# EAGLE design circuit_0.3.1 (EAGLE 7.7.0)
REV: 1
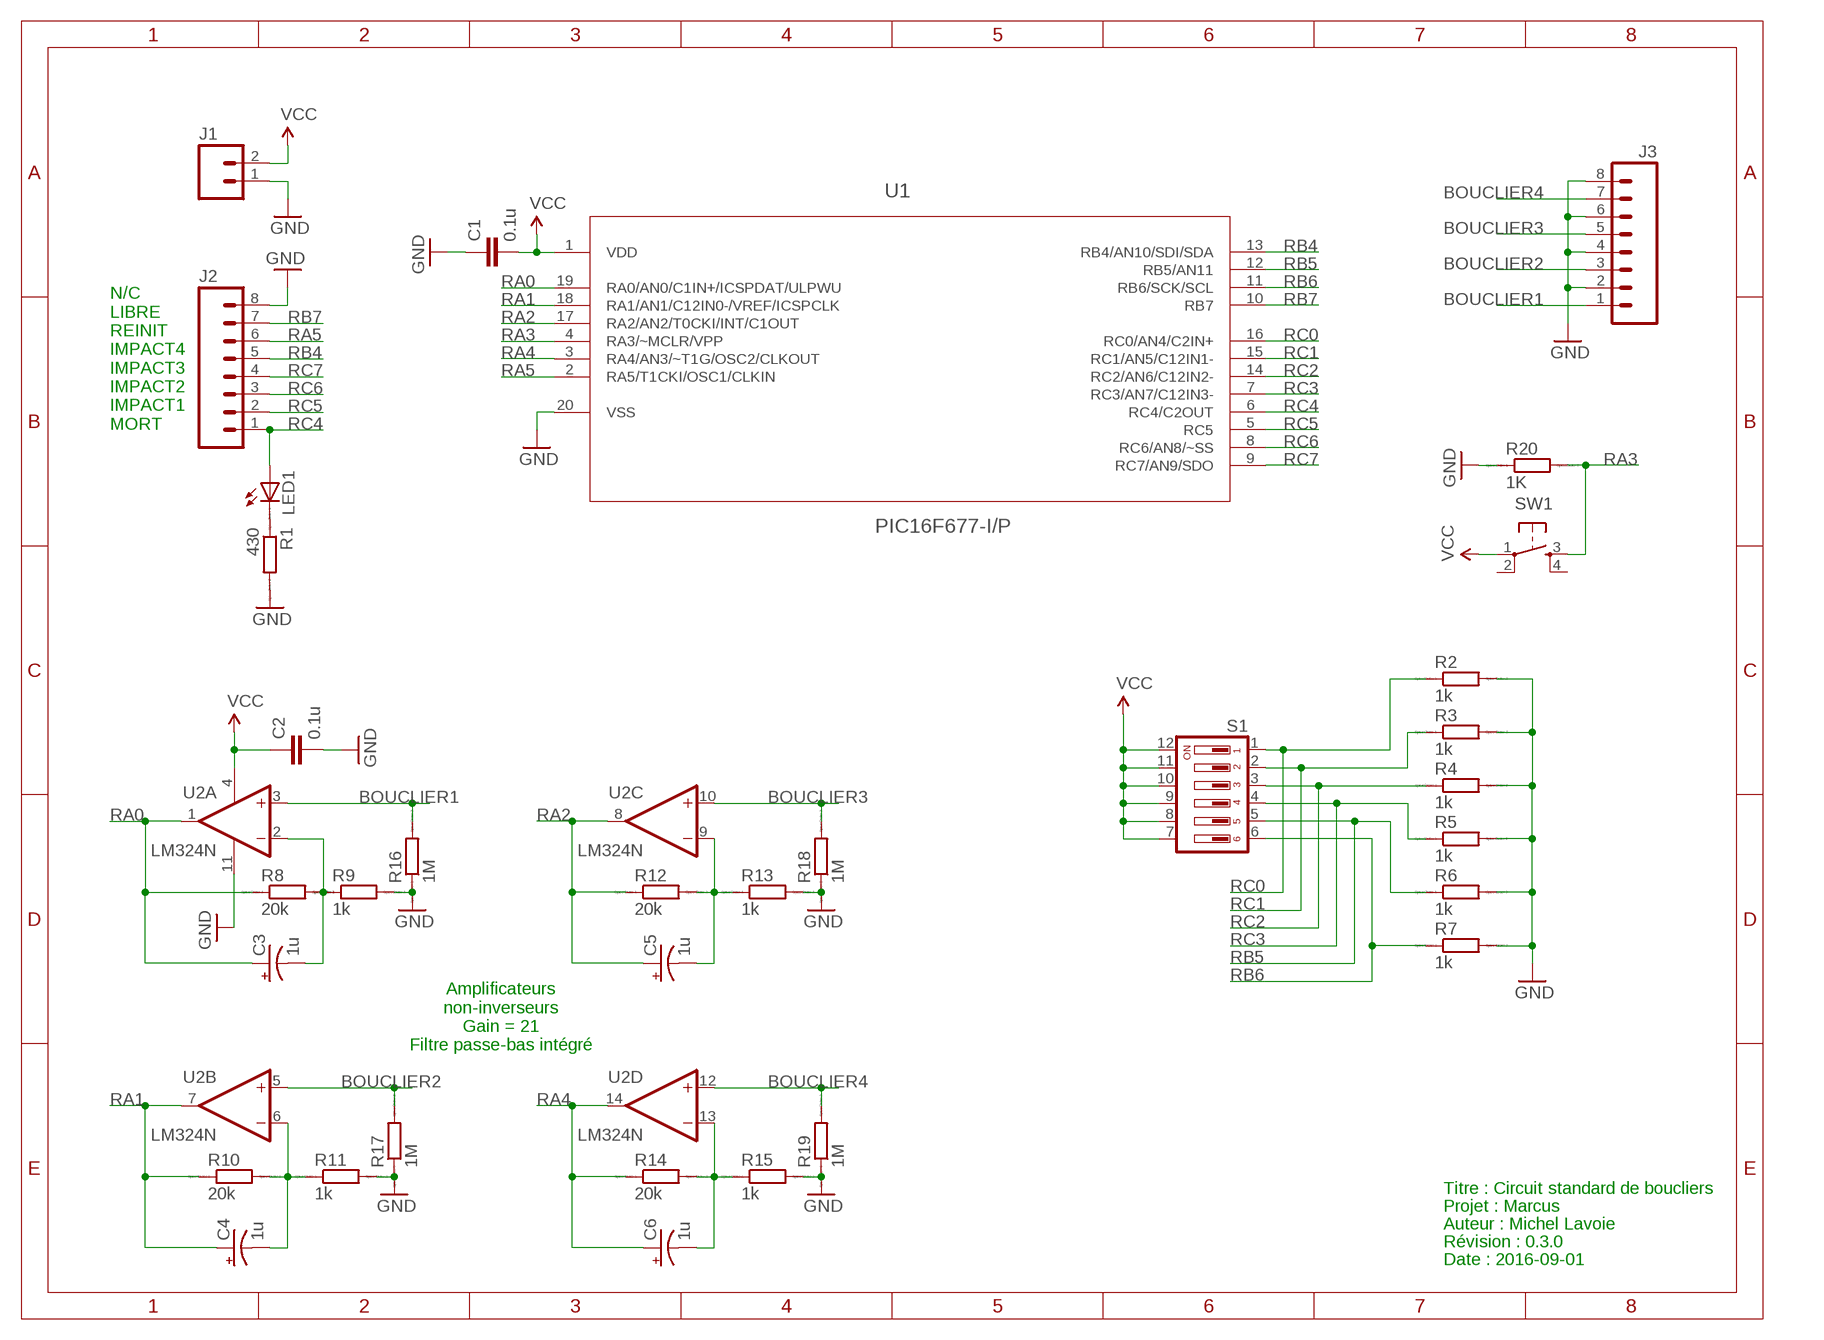
[diagram p0: schematic, sheet 1]

## Parts
C1  0.1u  CAPPTH  [CAP-PTH-SMALL]
C2  0.1u  CAPPTH  [CAP-PTH-SMALL]
C3  1u  CPOL-USE2.5-5  [E2,5-5]
C4  1u  CPOL-USE2.5-5  [E2,5-5]
C5  1u  CPOL-USE2.5-5  [E2,5-5]
C6  1u  CPOL-USE2.5-5  [E2,5-5]
J1  M02PTH  [1X02]
J2  M08NO_SILK  [1X08_PIN1_NO_SILK]
J3  M08NO_SILK  [1X08_PIN1_NO_SILK]
LED1  LED3MM  [LED3MM]
R1  430  R0207/10  [0207/10]
R2  1k  R0207/10  [0207/10]
R3  1k  R0207/10  [0207/10]
R4  1k  R0207/10  [0207/10]
R5  1k  R0207/10  [0207/10]
R6  1k  R0207/10  [0207/10]
R7  1k  R0207/10  [0207/10]
R8  20k  R0207/10  [0207/10]
R9  1k  R0207/10  [0207/10]
R10  20k  R0207/10  [0207/10]
R11  1k  R0207/10  [0207/10]
R12  20k  R0207/10  [0207/10]
R13  1k  R0207/10  [0207/10]
R14  20k  R0207/10  [0207/10]
R15  1k  R0207/10  [0207/10]
R16  1M  R0207/10  [0207/10]
R17  1M  R0207/10  [0207/10]
R18  1M  R0207/10  [0207/10]
R19  1M  R0207/10  [0207/10]
R20  1K  R0207/10  [0207/10]
S1  DIP06YL  [DIP06YL]
SW1  TAC_SWITCHPTH  [TACTILE-PTH]
U1  PIC16F677-I/P  [DIP254P762X533-20]
U2  LM324N  [DIL14]

## Nets
BOUCLIER1: J3.1 R16.2 U2.3(A:+IN)
BOUCLIER2: J3.3 R17.2 U2.5(B:+IN)
BOUCLIER3: J3.5 R18.2 U2.10(C:+IN)
BOUCLIER4: J3.7 R19.2 U2.12(D:+IN)
GND: C1.1 C2.2 J1.1 J2.8 J3.2 J3.4 J3.6 J3.8 R1.2 R2.2 R3.2 R4.2 R5.2 R6.2 R7.2 R9.2 R11.2 R13.2 R15.2 R16.1 R17.1 R18.1 R19.1 R20.1 U1.20(VSS) U2.11(P:V-)
N$1: C4.- R10.2 R11.1 U2.6(B:-IN)
N$2: LED1.K(C) R1.1
N$3: C3.- R8.2 R9.1 U2.2(A:-IN)
N$5: C5.- R12.2 R13.1 U2.9(C:-IN)
N$6: C6.- R14.2 R15.1 U2.13(D:-IN)
RA0: C3.+ R8.1 U1.19(RA0/AN0/C1IN+/ICSPDAT/ULPWU) U2.1(A:OUT)
RA1: C4.+ R10.1 U1.18(RA1/AN1/C12IN0-/VREF/ICSPCLK) U2.7(B:OUT)
RA2: C5.+ R12.1 U1.17(RA2/AN2/T0CKI/INT/C1OUT) U2.8(C:OUT)
RA3: R20.2 SW1.3 U1.4(RA3/~MCLR/VPP)
RA4: C6.+ R14.1 U1.3(RA4/AN3/~T1G/OSC2/CLKOUT) U2.14(D:OUT)
RA5: J2.6 U1.2(RA5/T1CKI/OSC1/CLKIN)
RB4: J2.5 U1.13(RB4/AN10/SDI/SDA)
RB5: R6.1 S1.5 U1.12(RB5/AN11)
RB6: R7.1 S1.6 U1.11(RB6/SCK/SCL)
RB7: J2.7 U1.10(RB7)
RC0: R2.1 S1.1 U1.16(RC0/AN4/C2IN+)
RC1: R3.1 S1.2 U1.15(RC1/AN5/C12IN1-)
RC2: R4.1 S1.3 U1.14(RC2/AN6/C12IN2-)
RC3: R5.1 S1.4 U1.7(RC3/AN7/C12IN3-)
RC4: J2.1 LED1.A U1.6(RC4/C2OUT)
RC5: J2.2 U1.5(RC5)
RC6: J2.3 U1.8(RC6/AN8/~SS)
RC7: J2.4 U1.9(RC7/AN9/SDO)
VCC: C1.2 C2.1 J1.2 S1.7 S1.8 S1.9 S1.10 S1.11 S1.12 SW1.1 U1.1(VDD) U2.4(P:V+)
Unconnected: SW1.2 SW1.4

## Notes on the sheet
- N/C
  LIBRE
  REINIT
  IMPACT4
  IMPACT3
  IMPACT2
  IMPACT1
  MORT
- Amplificateurs
  non-inverseurs
  Gain = 21
  Filtre passe-bas intégré
- Titre : Circuit standard de boucliers
- Projet : Marcus
- Auteur : Michel Lavoie
- Révision : 0.3.0
- Date : 2016-09-01

## Library data of the parts
C1 C2 = SparkFun-Capacitors:CAP: Capacitor Standard 0603 ceramic capacitor, and 0.1" leaded capacitor.
C3-C6 = adafruit:CPOL-US: POLARIZED CAPACITOR, American symbol
J1 = SparkFun-Connectors:M02: Standard 2-pin 0.1" header. Use with - straight break away headers ( PRT-00116) - right angle break away headers (PRT-00553) - swiss pins (PRT-00743) - machine pins (PRT-00117) - female headers (PRT-00115) Molex polarized connector foot print use with: PRT-08233 with associated crimp pins and housings. 2.54_SCREWTERM for use with PRT-10571. 3.5mm Screw Terminal footprints for PRT-08084 5mm Screw Terminal footprints for use with PRT-08432
J2 J3 = SparkFun-Connectors:M08: Header 8 Standard 8-pin 0.1" header. Use with straight break away headers (SKU : PRT-00116), right angle break away headers (PRT-00553), swiss pins (PRT-00743), machine pins (PRT-00117), and female headers (PRT-00115).
LED1 = adafruit:LED: LED OSRAM: - CHIPLED LG R971, LG N971, LY N971, LG Q971, LY Q971, LO R971, LY R971 LH N974, LH R974 LS Q976, LO Q976, LY Q976 LO Q996 - Hyper CHIPLED LW Q18S LB Q993, LB Q99A, LB R99A - SideLED LS A670, LO A670, LY A670, LG A670, LP A670 LB A673, LV A673, LT A673, LW A673 LH A674 LY A675 LS A676, LA A676, LO A676, LY A676, LW A676 LS A679, LY A679, LG A679 - Hyper Micro SIDELED® LS Y876, LA Y876, LO Y876, LY Y876 LT Y87S - SmartLED LW L88C, LW L88S LB L89C, LB L89S, LG L890 LS L89K, LO L89K, LY L89K LS L896, LA L896, LO L896, LY L896 - TOPLED LS T670, LO T670, LY T670, LG T670, LP T670 LSG T670, LSP T670, LSY T670, LOP T670, LYG T670 LG T671, LOG T671, LSG T671 LB T673, LV T673, LT T673, LW T673 LH T674 LS T676, LA T676, LO T676, LY T676, LB T676, LH T676, LSB T676, LW T676 LB T67C, LV T67C, LT T67C, LS T67K, LO T67K, LY T67K, LW E67C LS E67B, LA E67B, LO E67B, LY E67B, LB E67C, LV E67C, LT E67C LW T67C LS T679, LY T679, LG T679 LS T770, LO T770, LY T770, LG T770, LP T770 LB T773, LV T773, LT T773, LW T773 LH T774 LS E675, LA E675, LY E675, LS T675 LS T776, LA T776, LO T776, LY T776, LB T776 LHGB T686 LT T68C, LB T68C - Hyper Mini TOPLED® LB M676 - Mini TOPLED Santana® LG M470 LS M47K, LO M47K, LY M47K Source: http://www.osram.convergy.de/
R1-R20 = eagle-ltspice:R: RESISTOR, European symbol; SPICEMODEL: NONE; SPICEPREFIX: R
S1 = switch-dil:DIP06YL: DIL/CODE SWITCH; OC_FARNELL: unknown; OC_NEWARK: unknown
SW1 = SparkFun-Retired:TAC_SWITCH: Momentary Switch Button commonly used for reset or general input. Spark Fun Electronics SKU : COM-00097 SMT- SWCH-08247
U1 = Microchip_By_element14_Batch_1:PIC16F677-I/P: 8 Bit CMOS Microcontrollers; MPN: PIC16F677-I/P; OC_FARNELL: 1332206; OC_NEWARK: 56J7509; PACKAGE: PDIP-20; SUPPLIER: Microchip
U2 = linear:LM324: OP AMP

## Net classes
0 default: width 0.254 mm, clearance 0.305 mm

## Board
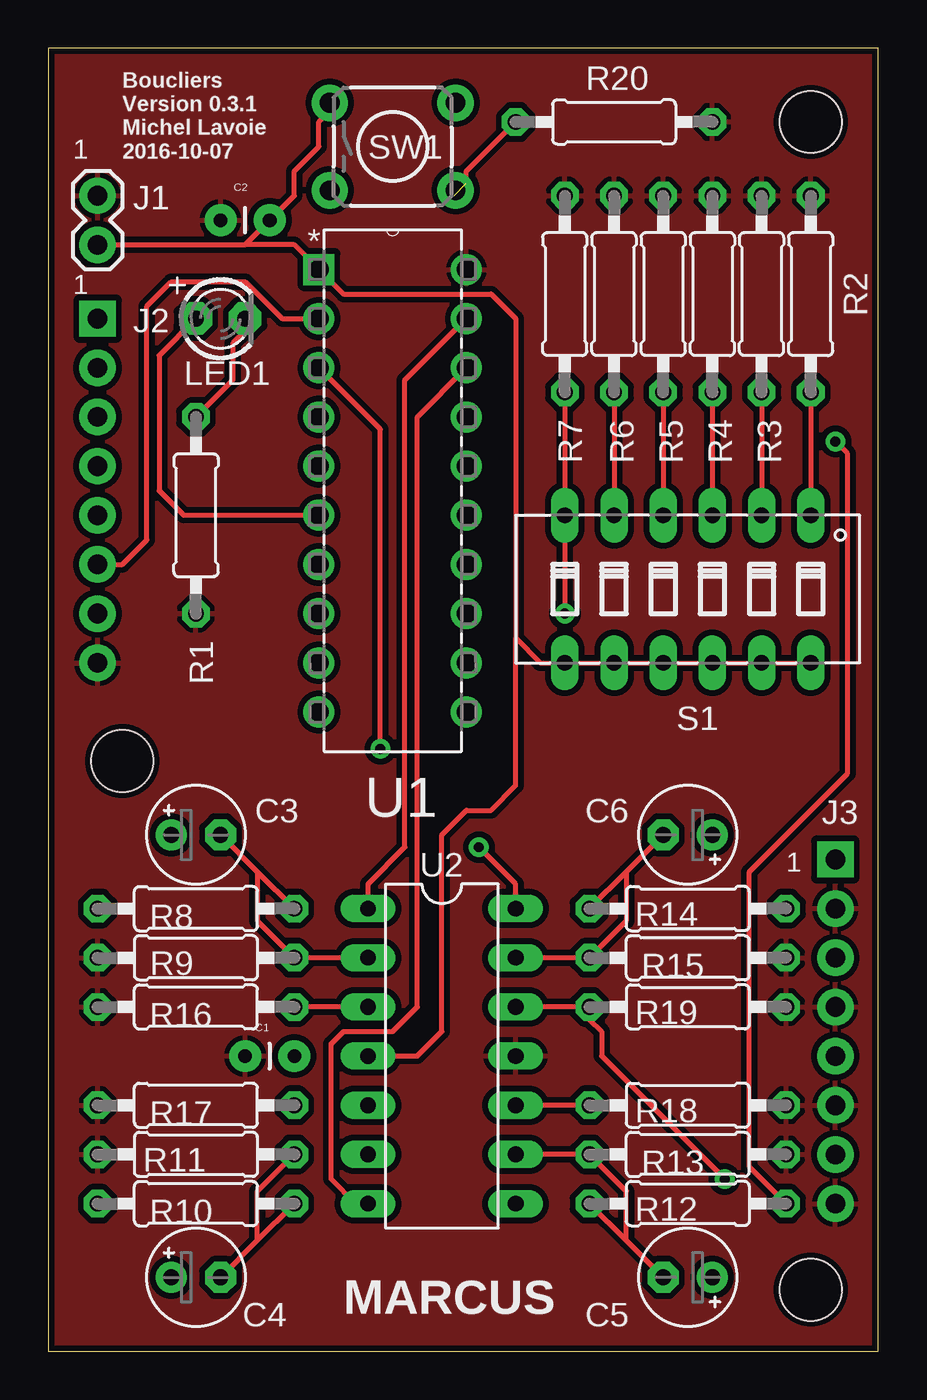
[diagram p1: board, top side]
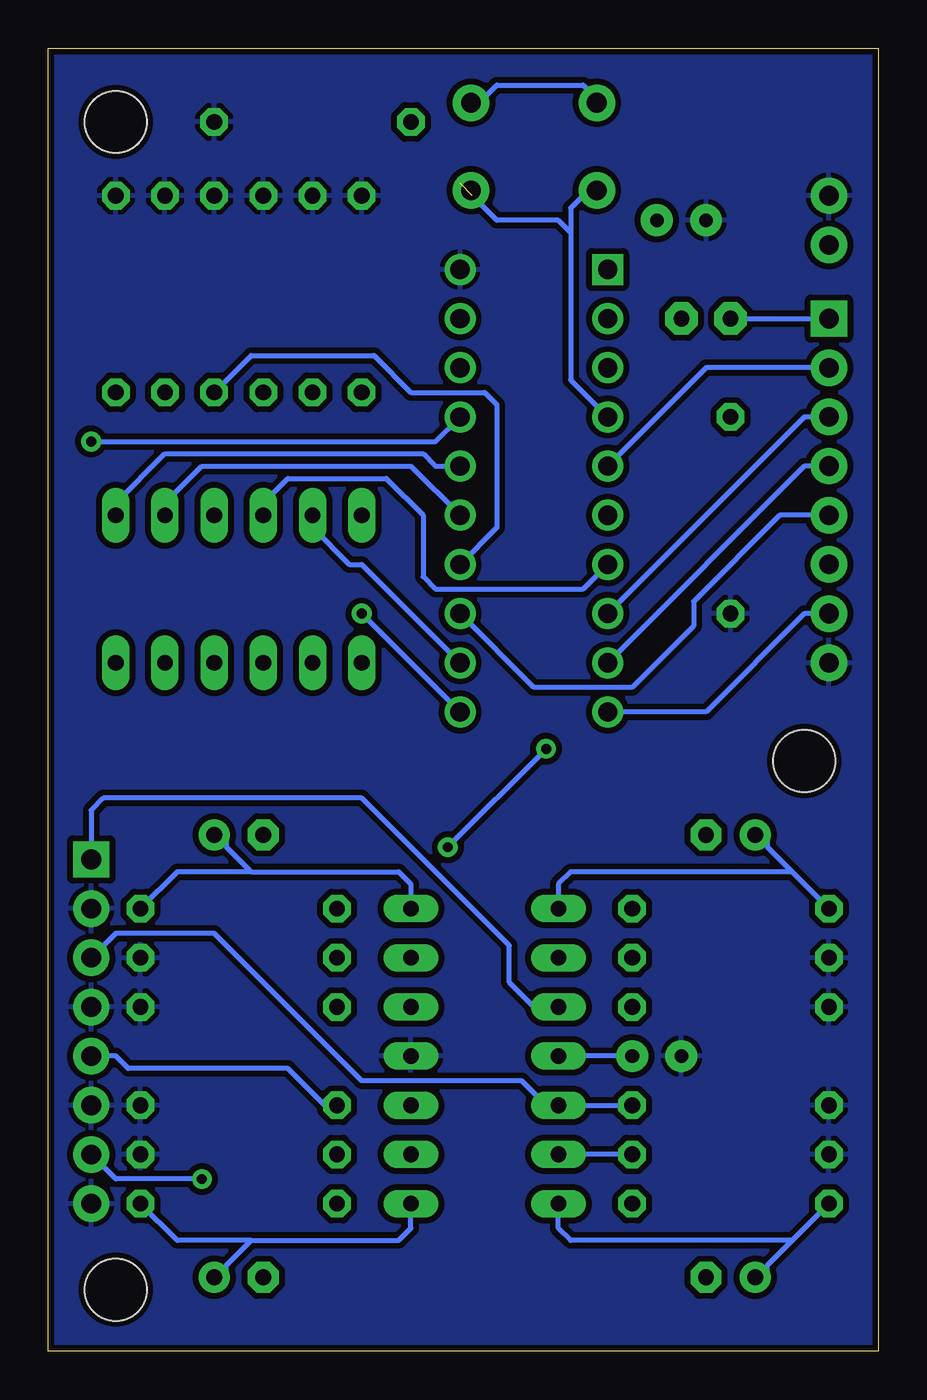
[diagram p2: board, bottom side, seen from below]

Size 42.85 x 67.3 mm. Coordinates in mm from the lower left corner, seen from the top.
Outline: 0,0 42.85,0 42.85,67.3 0,67.3 0,0
Copper layers (1*16): Top 0.035mm / dielectric 1.5mm / Bottom 0.035mm
Design rules "SparkFun": minimum track width 8mil, minimum drill 20mil, track to track 8mil, track to pad 8mil, pad to pad 8mil, via to via 8mil, smd to smd 8mil, copper to edge 8mil, drill to drill 8mil, minimum pad ring 12mil, minimum via ring 10mil, stop-mask expansion 4mil, vias tented up to drill 20mil, thermal gap 10mil
Holes 3.2 mm at 39.37,3.17 39.37,63.5 3.81,30.48

### Footprints (pad centres in the part's own frame; a part is rotated, then mirrored left to right if it is on the bottom)
CAP-PTH-SMALL = drill 0.7 pad 1.651: 1 0,0; 2 2.54,0
E2,5-5 = drill 0.813 pad 1.6: + -1.27,0 | drill 0.813 pad 1.6 octagon: - 1.27,0
1X02 = drill 1.016 pad 1.88: 1 0,0; 2 2.54,0
1X08_PIN1_NO_SILK = drill 1.016 pad 1.88 square: 1 0,0 | drill 1.016 pad 1.88: 2 2.54,0; 3 5.08,0; 4 7.62,0; 5 10.16,0; 6 12.7,0; 7 15.24,0; 8 17.78,0
LED3MM = drill 0.813 pad 1.676 octagon: A -1.27,0; K 1.27,0
0207/10 = drill 0.813 octagon: 1 -5.08,0; 2 5.08,0
DIP06YL = drill 0.813 long: 1 -6.35,-3.81; 2 -3.81,-3.81; 3 -1.27,-3.81; 4 1.27,-3.81; 5 3.81,-3.81; 6 6.35,-3.81; 7 6.35,3.81; 8 3.81,3.81; 9 1.27,3.81; 10 -1.27,3.81; 11 -3.81,3.81; 12 -6.35,3.81
TACTILE-PTH = drill 1.016 pad 1.88: 1 -3.251,2.261; 2 3.251,2.261; 3 -3.251,-2.261; 4 3.251,-2.261
DIP254P762X533-20 = drill 0.991 square: 1 -7.62,22.86 | drill 0.991: 2 -7.62,20.32; 3 -7.62,17.78; 4 -7.62,15.24; 5 -7.62,12.7; 6 -7.62,10.16; 7 -7.62,7.62; 8 -7.62,5.08; 9 -7.62,2.54; 10 -7.62,0; 11 0,0; 12 0,2.54; 13 0,5.08; 14 0,7.62; 15 0,10.16; 16 0,12.7; 17 0,15.24; 18 0,17.78; 19 0,20.32; 20 0,22.86
DIL14 = drill 0.813 long: 1 -7.62,-3.81; 2 -5.08,-3.81; 3 -2.54,-3.81; 4 0,-3.81; 5 2.54,-3.81; 6 5.08,-3.81; 7 7.62,-3.81; 8 7.62,3.81; 9 5.08,3.81; 10 2.54,3.81; 11 0,3.81; 12 -2.54,3.81; 13 -5.08,3.81; 14 -7.62,3.81

### Placement (x,y rotation side)
C1  10.16,15.24 0 top
C2  11.43,58.42 180 top
C3  7.62,26.67 0 top
C4  7.62,3.81 0 top
C5  33.02,3.81 180 top
C6  33.02,26.67 180 top
J1  2.54,59.69 270 top
J2  2.54,53.34 270 top
J3  40.64,25.4 270 top
LED1  8.89,53.34 0 top
R1  7.62,43.18 270 top
R2  39.37,54.61 90 top
R3  36.83,54.61 90 top
R4  34.29,54.61 90 top
R5  31.75,54.61 90 top
R6  29.21,54.61 90 top
R7  26.67,54.61 90 top
R8  7.62,22.86 0 top
R9  7.62,20.32 180 top
R10  7.62,7.62 0 top
R11  7.62,10.16 180 top
R12  33.02,7.62 180 top
R13  33.02,10.16 0 top
R14  33.02,22.86 180 top
R15  33.02,20.32 0 top
R16  7.62,17.78 0 top
R17  7.62,12.7 0 top
R18  33.02,12.7 180 top
R19  33.02,17.78 180 top
R20  29.21,63.5 180 top
S1  33.02,39.37 180 top
SW1  17.78,62.23 0 top
U1  21.59,33.02 0 top
U2  20.32,15.24 270 top

### Tracks (layer width: path | path; a pad name or v marks a point on that pad's centre or on a via)
BOUCLIER1
  Top 0.254: U2.3 R16.2
  Bottom 0.254: J3.1 40.64,27.94 40.01,28.57 26.67,28.57 19.05,20.95 19.05,19.05 17.78,17.78 U2.3
BOUCLIER2
  Bottom 0.254: R17.2 U2.5 17.14,12.7 18.41,13.97 26.67,13.97 34.29,21.59 39.37,21.59 J3.3
BOUCLIER3
  Top 0.254: R18.2 U2.10
  Bottom 0.254: J3.5 39.37,15.24 38.73,14.61 30.48,14.61 28.57,12.7 R18.2
BOUCLIER4  (via drill 0.51)
  Top 0.254: U2.12 R19.2 27.94,17.14 28.57,16.51 28.57,15.24 v34.92,8.89
  Bottom 0.254: J3.7 39.37,8.89 v34.92,8.89
GND
  pour Top (isolate 0.305): 0,67.31 43.18,67.31 43.18,0 0,0
  pour Bottom (isolate 0.305): 0,0 0,67.31 43.18,67.31 43.18,0
N$1
  Top 0.254: C4.- 10.79,5.71 | 10.79,5.71 R10.2 | R11.1 10.79,8.26 10.79,5.71
  Bottom 0.254: R11.1 U2.6
N$2
  Top 0.254: R1.1 9.53,50.16 9.53,52.07 10.16,52.7 LED1.K
N$3
  Top 0.254: U2.2 R9.1 10.79,22.23 10.79,24.77 | C3.- 10.79,24.77 | 10.79,24.77 R8.2
N$5
  Top 0.254: U2.9 R13.1 29.84,8.26 29.84,5.71 | C5.- 29.84,5.71 | 29.84,5.71 R12.2
N$6
  Top 0.254: U2.13 R15.1 29.84,22.23 29.84,24.77 | C6.- 29.84,24.77 | 29.84,24.77 R14.2
RA0
  Top 0.254: U1.19 18.41,50.16 18.41,26.04 16.51,24.13 U2.1
  Bottom 0.254: 4.45,24.77 5.71,26.04 5.71,26.67 C3.+ | 4.45,24.77 R8.1 | U2.1 16.51,24.13 15.88,24.77 4.45,24.77
RA1
  Top 0.254: U1.18 19.05,48.26 19.05,17.78 17.78,16.51 15.24,16.51 14.61,15.88 14.61,8.89 15.88,7.62 U2.7
  Bottom 0.254: 4.45,5.71 5.71,4.45 5.71,3.81 C4.+ | 4.45,5.71 R10.1 | U2.7 16.51,6.35 15.88,5.71 4.45,5.71
RA2  (via drill 0.51)
  Top 0.254: v40.64,46.99 41.27,46.35 41.27,29.84 36.2,24.77 36.2,9.53 R12.1
  Bottom 0.254: U2.8 24.13,6.35 24.77,5.71 32.38,5.71 | 32.38,5.71 33.66,4.45 33.66,3.81 C5.+ | R12.1 36.2,5.71 32.38,5.71 | U1.17 22.86,46.99 v40.64,46.99
RA3  (1 unrouted)
  Top 0.254: R20.2 21.59,60.96 21.59,60.33
  Bottom 0.254: U1.4 15.88,50.16 15.88,57.78 | 15.88,57.78 15.88,59.05 15.24,59.69 14.61,59.69 SW1.3 | 20.95,59.69 19.68,58.42 16.51,58.42 15.88,57.78
RA4  (via drill 0.51)
  Top 0.254: U1.3 17.14,47.62 v17.14,31.11 | v22.23,26.04 24.13,24.13 U2.14
  Bottom 0.254: U2.14 24.13,24.13 24.77,24.77 32.38,24.77 | 32.38,24.77 33.66,26.04 33.66,26.67 C6.+ | R14.1 36.2,24.77 32.38,24.77 | v22.23,26.04 v17.14,31.11
RA5
  Top 0.254: U1.2 12.06,53.34 10.16,55.24 6.35,55.24 5.08,53.98 5.08,41.91 3.81,40.64 J2.6
RB4
  Bottom 0.254: U1.13 17.78,34.29 12.7,34.29 9.53,37.47 9.53,38.73 5.08,43.18 J2.5
RB5
  Top 0.254: R6.1 S1.5
  Bottom 0.254: U1.12 26.67,40.64 27.3,40.64 29.21,42.55 S1.5
RB6  (via drill 0.51)
  Top 0.254: R7.1 S1.6 v26.67,38.1
  Bottom 0.254: v26.67,38.1 U1.11
RB7
  Bottom 0.254: U1.10 8.89,33.02 3.81,38.1 J2.7
RC0
  Top 0.254: R2.1 S1.1
  Bottom 0.254: U1.16 22.86,45.72 23.5,46.35 36.83,46.35 39.37,43.81 S1.1
RC1
  Top 0.254: R3.1 S1.2
  Bottom 0.254: U1.15 24.13,45.72 34.92,45.72 36.83,43.81 S1.2
RC2
  Top 0.254: R4.1 S1.3
  Bottom 0.254: U1.14 19.68,42.55 19.68,48.9 20.32,49.53 24.13,49.53 26.04,51.44 32.38,51.44 R4.1
RC3
  Top 0.254: R5.1 S1.4
  Bottom 0.254: U1.7 15.24,39.37 22.86,39.37 23.5,40.01 23.5,43.18 25.4,45.09 30.48,45.09 31.75,43.81 S1.4
RC4
  Top 0.254: U1.6 6.99,43.18 5.71,44.45 5.71,51.44 LED1.A
  Bottom 0.254: LED1.A J2.1
RC5
  Bottom 0.254: U1.5 8.89,50.8 J2.2
RC6
  Bottom 0.254: U1.8 3.81,48.26 J2.3
RC7
  Bottom 0.254: U1.9 3.81,45.72 J2.4
VCC
  Top 0.254: J1.2 10.16,57.15 | 10.16,57.15 C2.1 12.7,59.69 12.7,60.96 13.97,62.23 13.97,63.5 14.53,64.06 SW1.1 | 10.16,57.15 12.7,57.15 U1.1 15.24,54.61 22.86,54.61 24.13,53.34 24.13,36.83 | 24.13,36.83 25.4,35.56 S1.7 S1.8 S1.9 S1.10 S1.11 S1.12 | U2.4 19.05,15.24 20.32,16.51 20.32,26.67 21.59,27.94 22.86,27.94 24.13,29.21 24.13,36.83
  Bottom 0.254: 20.95,64.77 20.32,64.77 19.68,65.41 15.24,65.41 14.61,64.77 SW1.1 | C1.2 U2.4

### Text on the board
tPlace: 1 | Boucliers / Version 0.3.1 / Michel Lavoie / 2016-10-07 | 1 | 1 | MARCUS